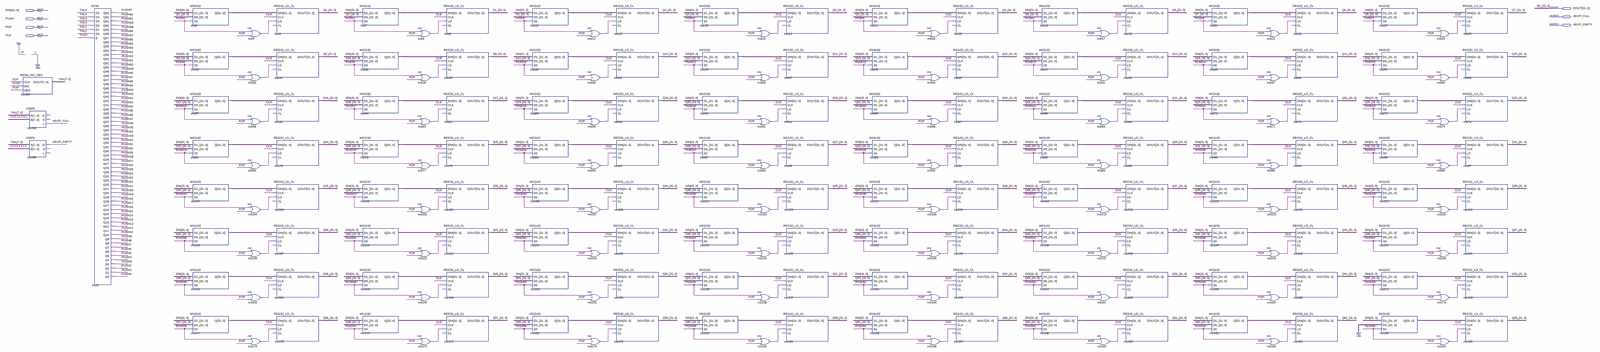
[diagram p0: schematic sheet, whole]
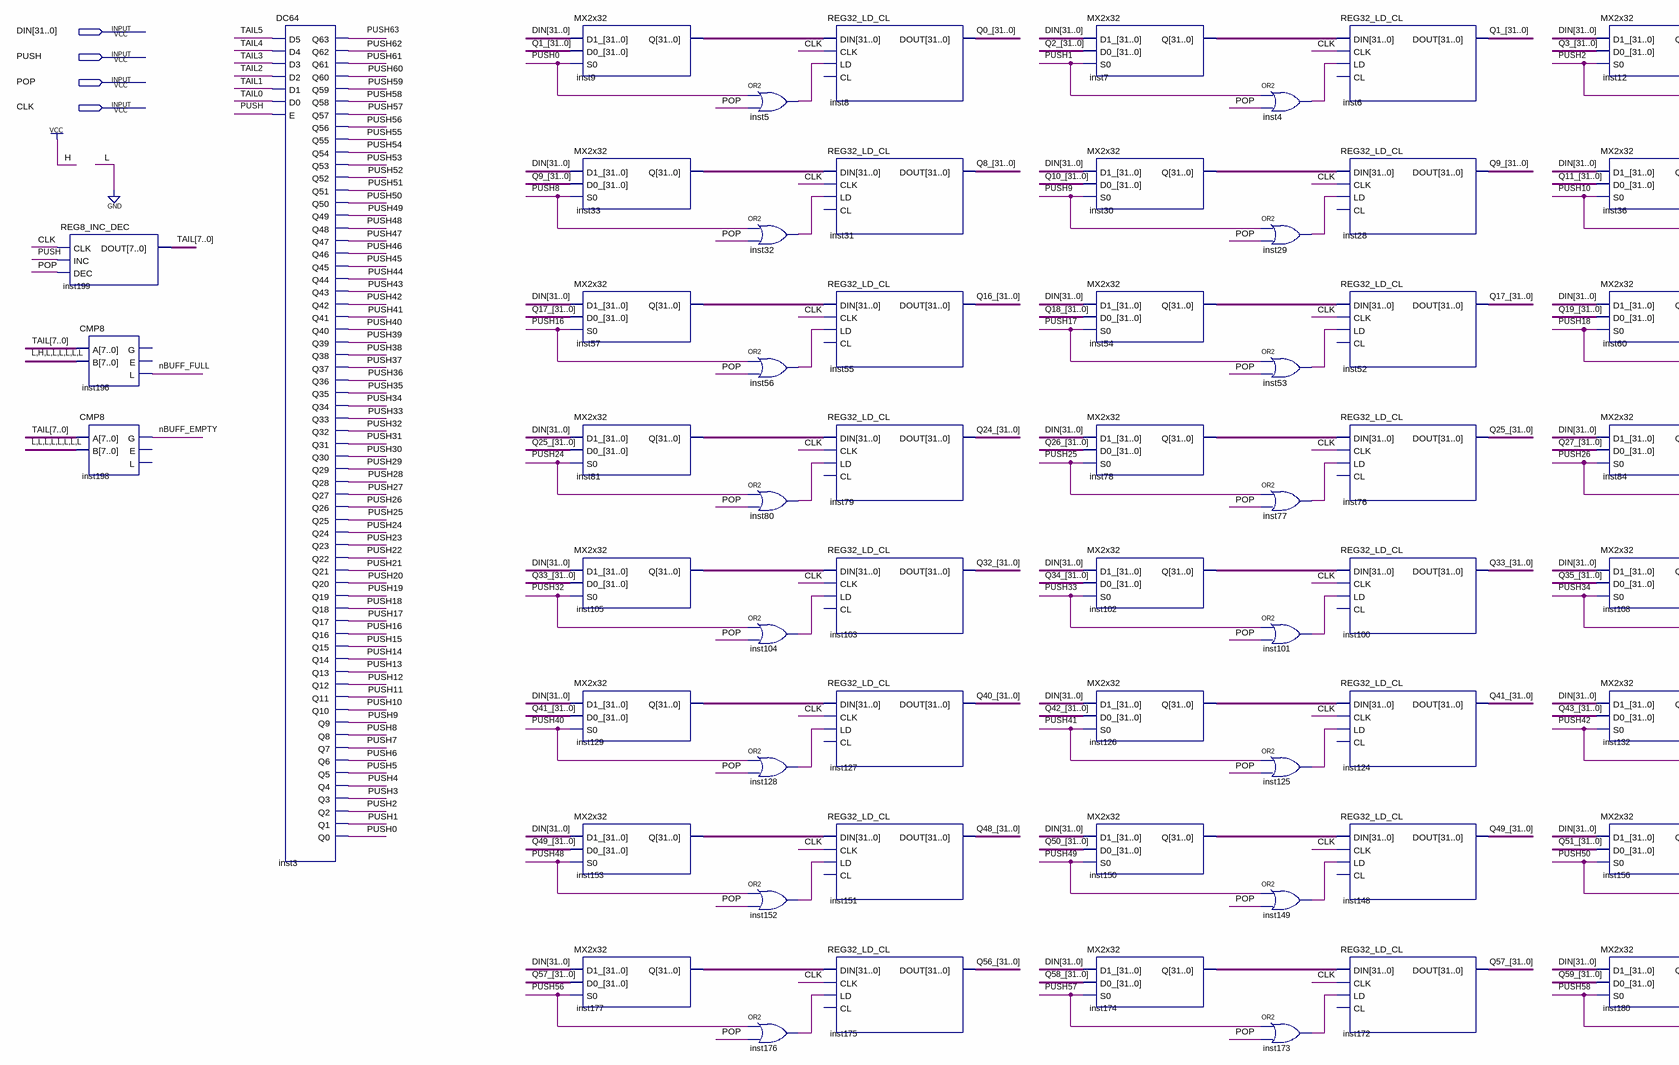
[diagram p1: schematic sheet, left part]
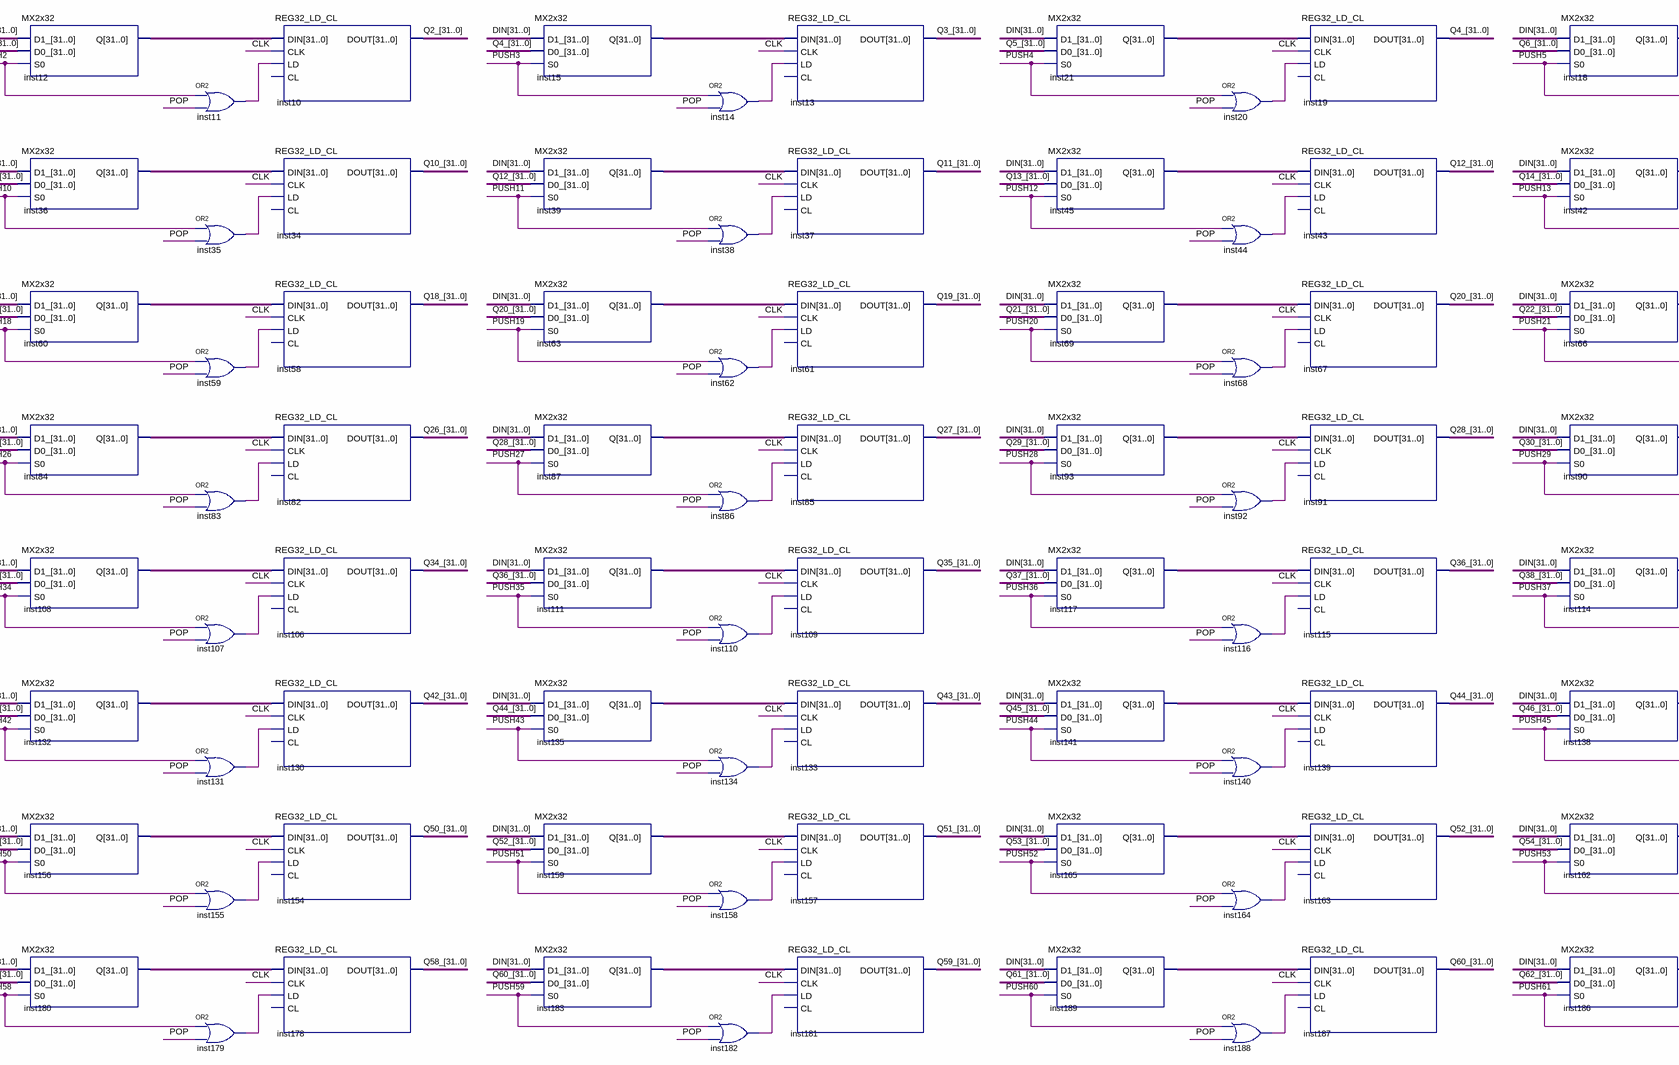
[diagram p2: schematic sheet, centre part]
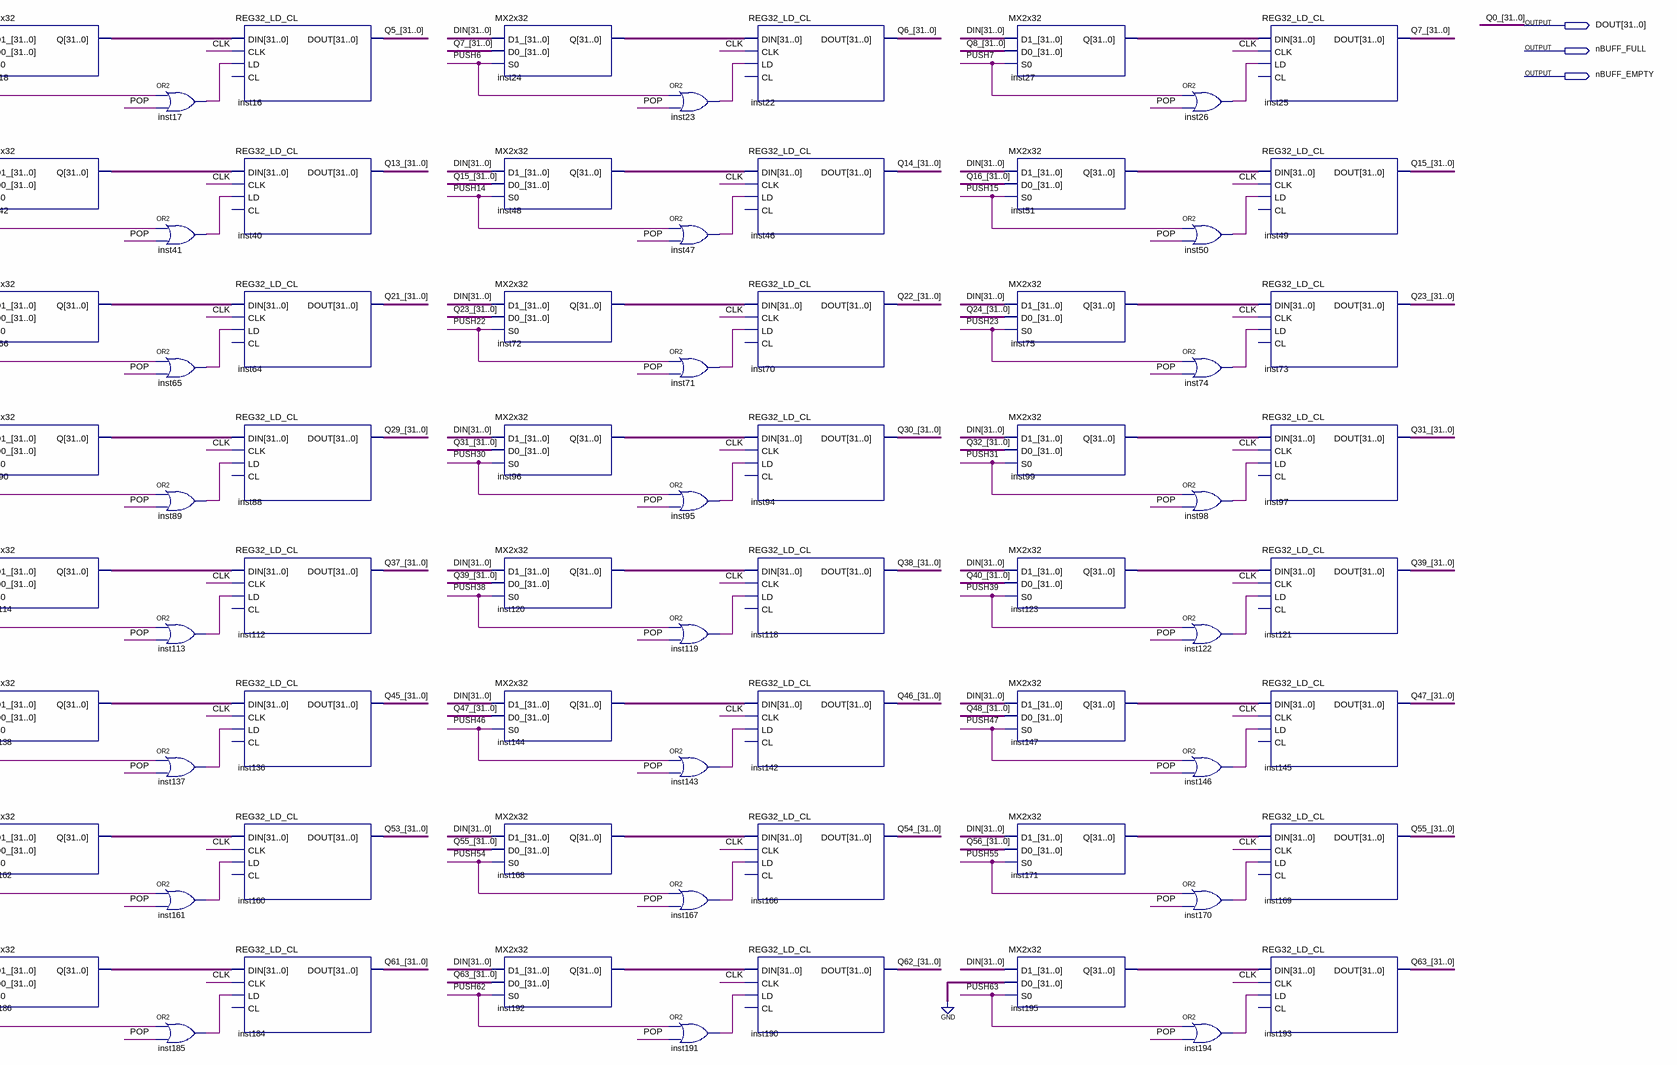
[diagram p3: schematic sheet, right part]
// Quartus schematic pixel_buffer.bdf as structural Verilog: 196 symbols, 7 pins
module pixel_buffer (
  input  [31:0] DIN,
  input  PUSH,
  input  POP,
  input  CLK,
  output [31:0] DOUT,
  output nBUFF_FULL,
  output nBUFF_EMPTY
);

  wire inst4_out, inst5_out, inst11_out, inst14_out, inst17_out, inst20_out, inst23_out, inst26_out,
       inst29_out, inst32_out, inst35_out, inst38_out, inst41_out, inst44_out, inst47_out, inst50_out,
       inst53_out, inst56_out, inst59_out, inst62_out, inst65_out, inst68_out, inst71_out, inst74_out,
       inst77_out, inst80_out, inst83_out, inst86_out, inst89_out, inst92_out, inst95_out, inst98_out,
       inst101_out, inst104_out, inst107_out, inst110_out, inst113_out, inst116_out, inst119_out,
       inst122_out, inst125_out, inst128_out, inst131_out, inst134_out, inst137_out, inst140_out,
       inst143_out, inst146_out, inst149_out, inst152_out, inst155_out, inst158_out, inst161_out,
       inst164_out, inst167_out, inst170_out, inst173_out, inst176_out, inst179_out, inst182_out,
       inst185_out, inst188_out, inst191_out, inst194_out, PUSH0, PUSH1, PUSH2, PUSH3, PUSH4, PUSH5, PUSH6,
       PUSH7, PUSH8, PUSH9, PUSH10, PUSH11, PUSH12, PUSH13, PUSH14, PUSH15, PUSH16, PUSH17, PUSH18, PUSH19,
       PUSH20, PUSH21, PUSH22, PUSH23, PUSH24, PUSH25, PUSH26, PUSH27, PUSH28, PUSH29, PUSH30, PUSH31,
       PUSH32, PUSH33, PUSH34, PUSH35, PUSH36, PUSH37, PUSH38, PUSH39, PUSH40, PUSH41, PUSH42, PUSH43,
       PUSH44, PUSH45, PUSH46, PUSH47, PUSH48, PUSH49, PUSH50, PUSH51, PUSH52, PUSH53, PUSH54, PUSH55,
       PUSH56, PUSH57, PUSH58, PUSH59, PUSH60, PUSH61, PUSH62, PUSH63;
  wire [7:0] TAIL;
  wire [31:0] inst7_q, inst9_q, inst12_q, inst15_q, inst18_q, inst21_q, inst24_q, inst27_q, inst30_q,
       inst33_q, inst36_q, inst39_q, inst42_q, inst45_q, inst48_q, inst51_q, inst54_q, inst57_q, inst60_q,
       inst63_q, inst66_q, inst69_q, inst72_q, inst75_q, inst78_q, inst81_q, inst84_q, inst87_q, inst90_q,
       inst93_q, inst96_q, inst99_q, inst102_q, inst105_q, inst108_q, inst111_q, inst114_q, inst117_q,
       inst120_q, inst123_q, inst126_q, inst129_q, inst132_q, inst135_q, inst138_q, inst141_q, inst144_q,
       inst147_q, inst150_q, inst153_q, inst156_q, inst159_q, inst162_q, inst165_q, inst168_q, inst171_q,
       inst174_q, inst177_q, inst180_q, inst183_q, inst186_q, inst189_q, inst192_q, inst195_q, Q1_, Q2_, Q3_,
       Q4_, Q5_, Q6_, Q7_, Q8_, Q9_, Q10_, Q11_, Q12_, Q13_, Q14_, Q15_, Q16_, Q17_, Q18_, Q19_, Q20_, Q21_,
       Q22_, Q23_, Q24_, Q25_, Q26_, Q27_, Q28_, Q29_, Q30_, Q31_, Q32_, Q33_, Q34_, Q35_, Q36_, Q37_, Q38_,
       Q39_, Q40_, Q41_, Q42_, Q43_, Q44_, Q45_, Q46_, Q47_, Q48_, Q49_, Q50_, Q51_, Q52_, Q53_, Q54_, Q55_,
       Q56_, Q57_, Q58_, Q59_, Q60_, Q61_, Q62_, Q63_;

  REG8_INC_DEC inst199 (.CLK(CLK), .INC(PUSH), .DEC(POP), .DOUT(TAIL));
  CMP8 inst196 (.A(TAIL), .B(8'b01000000), .L(nBUFF_FULL));  // open: G, E
  CMP8 inst198 (.A(TAIL), .B({8{1'b0}}), .G(nBUFF_EMPTY));  // open: E, L
  DC64 inst3 (
    .D5(TAIL[5]), .D4(TAIL[4]), .D3(TAIL[3]), .D2(TAIL[2]), .D1(TAIL[1]), .D0(TAIL[0]), .E(PUSH),
    .Q63(PUSH63), .Q62(PUSH62), .Q61(PUSH61), .Q60(PUSH60), .Q59(PUSH59), .Q58(PUSH58), .Q57(PUSH57),
    .Q56(PUSH56), .Q55(PUSH55), .Q54(PUSH54), .Q53(PUSH53), .Q52(PUSH52), .Q51(PUSH51), .Q50(PUSH50),
    .Q49(PUSH49), .Q48(PUSH48), .Q47(PUSH47), .Q46(PUSH46), .Q45(PUSH45), .Q44(PUSH44), .Q43(PUSH43),
    .Q42(PUSH42), .Q41(PUSH41), .Q40(PUSH40), .Q39(PUSH39), .Q38(PUSH38), .Q37(PUSH37), .Q36(PUSH36),
    .Q35(PUSH35), .Q34(PUSH34), .Q33(PUSH33), .Q32(PUSH32), .Q31(PUSH31), .Q30(PUSH30), .Q29(PUSH29),
    .Q28(PUSH28), .Q27(PUSH27), .Q26(PUSH26), .Q25(PUSH25), .Q24(PUSH24), .Q23(PUSH23), .Q22(PUSH22),
    .Q21(PUSH21), .Q20(PUSH20), .Q19(PUSH19), .Q18(PUSH18), .Q17(PUSH17), .Q16(PUSH16), .Q15(PUSH15),
    .Q14(PUSH14), .Q13(PUSH13), .Q12(PUSH12), .Q11(PUSH11), .Q10(PUSH10), .Q9(PUSH9), .Q8(PUSH8), .Q7(PUSH7),
    .Q6(PUSH6), .Q5(PUSH5), .Q4(PUSH4), .Q3(PUSH3), .Q2(PUSH2), .Q1(PUSH1), .Q0(PUSH0));
  MX2x32 inst9 (.D1_(DIN), .D0_(Q1_), .S0(PUSH0), .Q(inst9_q));
  MX2x32 inst33 (.D1_(DIN), .D0_(Q9_), .S0(PUSH8), .Q(inst33_q));
  MX2x32 inst57 (.D1_(DIN), .D0_(Q17_), .S0(PUSH16), .Q(inst57_q));
  MX2x32 inst81 (.D1_(DIN), .D0_(Q25_), .S0(PUSH24), .Q(inst81_q));
  MX2x32 inst105 (.D1_(DIN), .D0_(Q33_), .S0(PUSH32), .Q(inst105_q));
  MX2x32 inst129 (.D1_(DIN), .D0_(Q41_), .S0(PUSH40), .Q(inst129_q));
  MX2x32 inst153 (.D1_(DIN), .D0_(Q49_), .S0(PUSH48), .Q(inst153_q));
  MX2x32 inst177 (.D1_(DIN), .D0_(Q57_), .S0(PUSH56), .Q(inst177_q));
  or inst5 (inst5_out, PUSH0, POP);
  or inst32 (inst32_out, PUSH8, POP);
  or inst56 (inst56_out, PUSH16, POP);
  or inst80 (inst80_out, PUSH24, POP);
  or inst104 (inst104_out, PUSH32, POP);
  or inst128 (inst128_out, PUSH40, POP);
  or inst152 (inst152_out, PUSH48, POP);
  or inst176 (inst176_out, PUSH56, POP);
  REG32_LD_CL inst8 (.DIN(inst9_q), .CLK(CLK), .LD(inst5_out), .DOUT(DOUT));  // open: CL
  REG32_LD_CL inst31 (.DIN(inst33_q), .CLK(CLK), .LD(inst32_out), .DOUT(Q8_));  // open: CL
  REG32_LD_CL inst55 (.DIN(inst57_q), .CLK(CLK), .LD(inst56_out), .DOUT(Q16_));  // open: CL
  REG32_LD_CL inst79 (.DIN(inst81_q), .CLK(CLK), .LD(inst80_out), .DOUT(Q24_));  // open: CL
  REG32_LD_CL inst103 (.DIN(inst105_q), .CLK(CLK), .LD(inst104_out), .DOUT(Q32_));  // open: CL
  REG32_LD_CL inst127 (.DIN(inst129_q), .CLK(CLK), .LD(inst128_out), .DOUT(Q40_));  // open: CL
  REG32_LD_CL inst151 (.DIN(inst153_q), .CLK(CLK), .LD(inst152_out), .DOUT(Q48_));  // open: CL
  REG32_LD_CL inst175 (.DIN(inst177_q), .CLK(CLK), .LD(inst176_out), .DOUT(Q56_));  // open: CL
  MX2x32 inst7 (.D1_(DIN), .D0_(Q2_), .S0(PUSH1), .Q(inst7_q));
  MX2x32 inst30 (.D1_(DIN), .D0_(Q10_), .S0(PUSH9), .Q(inst30_q));
  MX2x32 inst54 (.D1_(DIN), .D0_(Q18_), .S0(PUSH17), .Q(inst54_q));
  MX2x32 inst78 (.D1_(DIN), .D0_(Q26_), .S0(PUSH25), .Q(inst78_q));
  MX2x32 inst102 (.D1_(DIN), .D0_(Q34_), .S0(PUSH33), .Q(inst102_q));
  MX2x32 inst126 (.D1_(DIN), .D0_(Q42_), .S0(PUSH41), .Q(inst126_q));
  MX2x32 inst150 (.D1_(DIN), .D0_(Q50_), .S0(PUSH49), .Q(inst150_q));
  MX2x32 inst174 (.D1_(DIN), .D0_(Q58_), .S0(PUSH57), .Q(inst174_q));
  or inst4 (inst4_out, PUSH1, POP);
  or inst29 (inst29_out, PUSH9, POP);
  or inst53 (inst53_out, PUSH17, POP);
  or inst77 (inst77_out, PUSH25, POP);
  or inst101 (inst101_out, PUSH33, POP);
  or inst125 (inst125_out, PUSH41, POP);
  or inst149 (inst149_out, PUSH49, POP);
  or inst173 (inst173_out, PUSH57, POP);
  REG32_LD_CL inst6 (.DIN(inst7_q), .CLK(CLK), .LD(inst4_out), .DOUT(Q1_));  // open: CL
  REG32_LD_CL inst28 (.DIN(inst30_q), .CLK(CLK), .LD(inst29_out), .DOUT(Q9_));  // open: CL
  REG32_LD_CL inst52 (.DIN(inst54_q), .CLK(CLK), .LD(inst53_out), .DOUT(Q17_));  // open: CL
  REG32_LD_CL inst76 (.DIN(inst78_q), .CLK(CLK), .LD(inst77_out), .DOUT(Q25_));  // open: CL
  REG32_LD_CL inst100 (.DIN(inst102_q), .CLK(CLK), .LD(inst101_out), .DOUT(Q33_));  // open: CL
  REG32_LD_CL inst124 (.DIN(inst126_q), .CLK(CLK), .LD(inst125_out), .DOUT(Q41_));  // open: CL
  REG32_LD_CL inst148 (.DIN(inst150_q), .CLK(CLK), .LD(inst149_out), .DOUT(Q49_));  // open: CL
  REG32_LD_CL inst172 (.DIN(inst174_q), .CLK(CLK), .LD(inst173_out), .DOUT(Q57_));  // open: CL
  MX2x32 inst12 (.D1_(DIN), .D0_(Q3_), .S0(PUSH2), .Q(inst12_q));
  MX2x32 inst36 (.D1_(DIN), .D0_(Q11_), .S0(PUSH10), .Q(inst36_q));
  MX2x32 inst60 (.D1_(DIN), .D0_(Q19_), .S0(PUSH18), .Q(inst60_q));
  MX2x32 inst84 (.D1_(DIN), .D0_(Q27_), .S0(PUSH26), .Q(inst84_q));
  MX2x32 inst108 (.D1_(DIN), .D0_(Q35_), .S0(PUSH34), .Q(inst108_q));
  MX2x32 inst132 (.D1_(DIN), .D0_(Q43_), .S0(PUSH42), .Q(inst132_q));
  MX2x32 inst156 (.D1_(DIN), .D0_(Q51_), .S0(PUSH50), .Q(inst156_q));
  MX2x32 inst180 (.D1_(DIN), .D0_(Q59_), .S0(PUSH58), .Q(inst180_q));
  or inst11 (inst11_out, PUSH2, POP);
  or inst35 (inst35_out, PUSH10, POP);
  or inst59 (inst59_out, PUSH18, POP);
  or inst83 (inst83_out, PUSH26, POP);
  or inst107 (inst107_out, PUSH34, POP);
  or inst131 (inst131_out, PUSH42, POP);
  or inst155 (inst155_out, PUSH50, POP);
  or inst179 (inst179_out, PUSH58, POP);
  REG32_LD_CL inst10 (.DIN(inst12_q), .CLK(CLK), .LD(inst11_out), .DOUT(Q2_));  // open: CL
  REG32_LD_CL inst34 (.DIN(inst36_q), .CLK(CLK), .LD(inst35_out), .DOUT(Q10_));  // open: CL
  REG32_LD_CL inst58 (.DIN(inst60_q), .CLK(CLK), .LD(inst59_out), .DOUT(Q18_));  // open: CL
  REG32_LD_CL inst82 (.DIN(inst84_q), .CLK(CLK), .LD(inst83_out), .DOUT(Q26_));  // open: CL
  REG32_LD_CL inst106 (.DIN(inst108_q), .CLK(CLK), .LD(inst107_out), .DOUT(Q34_));  // open: CL
  REG32_LD_CL inst130 (.DIN(inst132_q), .CLK(CLK), .LD(inst131_out), .DOUT(Q42_));  // open: CL
  REG32_LD_CL inst154 (.DIN(inst156_q), .CLK(CLK), .LD(inst155_out), .DOUT(Q50_));  // open: CL
  REG32_LD_CL inst178 (.DIN(inst180_q), .CLK(CLK), .LD(inst179_out), .DOUT(Q58_));  // open: CL
  MX2x32 inst15 (.D1_(DIN), .D0_(Q4_), .S0(PUSH3), .Q(inst15_q));
  MX2x32 inst39 (.D1_(DIN), .D0_(Q12_), .S0(PUSH11), .Q(inst39_q));
  MX2x32 inst63 (.D1_(DIN), .D0_(Q20_), .S0(PUSH19), .Q(inst63_q));
  MX2x32 inst87 (.D1_(DIN), .D0_(Q28_), .S0(PUSH27), .Q(inst87_q));
  MX2x32 inst111 (.D1_(DIN), .D0_(Q36_), .S0(PUSH35), .Q(inst111_q));
  MX2x32 inst135 (.D1_(DIN), .D0_(Q44_), .S0(PUSH43), .Q(inst135_q));
  MX2x32 inst159 (.D1_(DIN), .D0_(Q52_), .S0(PUSH51), .Q(inst159_q));
  MX2x32 inst183 (.D1_(DIN), .D0_(Q60_), .S0(PUSH59), .Q(inst183_q));
  or inst14 (inst14_out, PUSH3, POP);
  or inst38 (inst38_out, PUSH11, POP);
  or inst62 (inst62_out, PUSH19, POP);
  or inst86 (inst86_out, PUSH27, POP);
  or inst110 (inst110_out, PUSH35, POP);
  or inst134 (inst134_out, PUSH43, POP);
  or inst158 (inst158_out, PUSH51, POP);
  or inst182 (inst182_out, PUSH59, POP);
  REG32_LD_CL inst13 (.DIN(inst15_q), .CLK(CLK), .LD(inst14_out), .DOUT(Q3_));  // open: CL
  REG32_LD_CL inst37 (.DIN(inst39_q), .CLK(CLK), .LD(inst38_out), .DOUT(Q11_));  // open: CL
  REG32_LD_CL inst61 (.DIN(inst63_q), .CLK(CLK), .LD(inst62_out), .DOUT(Q19_));  // open: CL
  REG32_LD_CL inst85 (.DIN(inst87_q), .CLK(CLK), .LD(inst86_out), .DOUT(Q27_));  // open: CL
  REG32_LD_CL inst109 (.DIN(inst111_q), .CLK(CLK), .LD(inst110_out), .DOUT(Q35_));  // open: CL
  REG32_LD_CL inst133 (.DIN(inst135_q), .CLK(CLK), .LD(inst134_out), .DOUT(Q43_));  // open: CL
  REG32_LD_CL inst157 (.DIN(inst159_q), .CLK(CLK), .LD(inst158_out), .DOUT(Q51_));  // open: CL
  REG32_LD_CL inst181 (.DIN(inst183_q), .CLK(CLK), .LD(inst182_out), .DOUT(Q59_));  // open: CL
  MX2x32 inst21 (.D1_(DIN), .D0_(Q5_), .S0(PUSH4), .Q(inst21_q));
  MX2x32 inst45 (.D1_(DIN), .D0_(Q13_), .S0(PUSH12), .Q(inst45_q));
  MX2x32 inst69 (.D1_(DIN), .D0_(Q21_), .S0(PUSH20), .Q(inst69_q));
  MX2x32 inst93 (.D1_(DIN), .D0_(Q29_), .S0(PUSH28), .Q(inst93_q));
  MX2x32 inst117 (.D1_(DIN), .D0_(Q37_), .S0(PUSH36), .Q(inst117_q));
  MX2x32 inst141 (.D1_(DIN), .D0_(Q45_), .S0(PUSH44), .Q(inst141_q));
  MX2x32 inst165 (.D1_(DIN), .D0_(Q53_), .S0(PUSH52), .Q(inst165_q));
  MX2x32 inst189 (.D1_(DIN), .D0_(Q61_), .S0(PUSH60), .Q(inst189_q));
  or inst20 (inst20_out, PUSH4, POP);
  or inst44 (inst44_out, PUSH12, POP);
  or inst68 (inst68_out, PUSH20, POP);
  or inst92 (inst92_out, PUSH28, POP);
  or inst116 (inst116_out, PUSH36, POP);
  or inst140 (inst140_out, PUSH44, POP);
  or inst164 (inst164_out, PUSH52, POP);
  or inst188 (inst188_out, PUSH60, POP);
  REG32_LD_CL inst19 (.DIN(inst21_q), .CLK(CLK), .LD(inst20_out), .DOUT(Q4_));  // open: CL
  REG32_LD_CL inst43 (.DIN(inst45_q), .CLK(CLK), .LD(inst44_out), .DOUT(Q12_));  // open: CL
  REG32_LD_CL inst67 (.DIN(inst69_q), .CLK(CLK), .LD(inst68_out), .DOUT(Q20_));  // open: CL
  REG32_LD_CL inst91 (.DIN(inst93_q), .CLK(CLK), .LD(inst92_out), .DOUT(Q28_));  // open: CL
  REG32_LD_CL inst115 (.DIN(inst117_q), .CLK(CLK), .LD(inst116_out), .DOUT(Q36_));  // open: CL
  REG32_LD_CL inst139 (.DIN(inst141_q), .CLK(CLK), .LD(inst140_out), .DOUT(Q44_));  // open: CL
  REG32_LD_CL inst163 (.DIN(inst165_q), .CLK(CLK), .LD(inst164_out), .DOUT(Q52_));  // open: CL
  REG32_LD_CL inst187 (.DIN(inst189_q), .CLK(CLK), .LD(inst188_out), .DOUT(Q60_));  // open: CL
  MX2x32 inst18 (.D1_(DIN), .D0_(Q6_), .S0(PUSH5), .Q(inst18_q));
  MX2x32 inst42 (.D1_(DIN), .D0_(Q14_), .S0(PUSH13), .Q(inst42_q));
  MX2x32 inst66 (.D1_(DIN), .D0_(Q22_), .S0(PUSH21), .Q(inst66_q));
  MX2x32 inst90 (.D1_(DIN), .D0_(Q30_), .S0(PUSH29), .Q(inst90_q));
  MX2x32 inst114 (.D1_(DIN), .D0_(Q38_), .S0(PUSH37), .Q(inst114_q));
  MX2x32 inst138 (.D1_(DIN), .D0_(Q46_), .S0(PUSH45), .Q(inst138_q));
  MX2x32 inst162 (.D1_(DIN), .D0_(Q54_), .S0(PUSH53), .Q(inst162_q));
  MX2x32 inst186 (.D1_(DIN), .D0_(Q62_), .S0(PUSH61), .Q(inst186_q));
  or inst17 (inst17_out, PUSH5, POP);
  or inst41 (inst41_out, PUSH13, POP);
  or inst65 (inst65_out, PUSH21, POP);
  or inst89 (inst89_out, PUSH29, POP);
  or inst113 (inst113_out, PUSH37, POP);
  or inst137 (inst137_out, PUSH45, POP);
  or inst161 (inst161_out, PUSH53, POP);
  or inst185 (inst185_out, PUSH61, POP);
  REG32_LD_CL inst16 (.DIN(inst18_q), .CLK(CLK), .LD(inst17_out), .DOUT(Q5_));  // open: CL
  REG32_LD_CL inst40 (.DIN(inst42_q), .CLK(CLK), .LD(inst41_out), .DOUT(Q13_));  // open: CL
  REG32_LD_CL inst64 (.DIN(inst66_q), .CLK(CLK), .LD(inst65_out), .DOUT(Q21_));  // open: CL
  REG32_LD_CL inst88 (.DIN(inst90_q), .CLK(CLK), .LD(inst89_out), .DOUT(Q29_));  // open: CL
  REG32_LD_CL inst112 (.DIN(inst114_q), .CLK(CLK), .LD(inst113_out), .DOUT(Q37_));  // open: CL
  REG32_LD_CL inst136 (.DIN(inst138_q), .CLK(CLK), .LD(inst137_out), .DOUT(Q45_));  // open: CL
  REG32_LD_CL inst160 (.DIN(inst162_q), .CLK(CLK), .LD(inst161_out), .DOUT(Q53_));  // open: CL
  REG32_LD_CL inst184 (.DIN(inst186_q), .CLK(CLK), .LD(inst185_out), .DOUT(Q61_));  // open: CL
  MX2x32 inst24 (.D1_(DIN), .D0_(Q7_), .S0(PUSH6), .Q(inst24_q));
  MX2x32 inst48 (.D1_(DIN), .D0_(Q15_), .S0(PUSH14), .Q(inst48_q));
  MX2x32 inst72 (.D1_(DIN), .D0_(Q23_), .S0(PUSH22), .Q(inst72_q));
  MX2x32 inst96 (.D1_(DIN), .D0_(Q31_), .S0(PUSH30), .Q(inst96_q));
  MX2x32 inst120 (.D1_(DIN), .D0_(Q39_), .S0(PUSH38), .Q(inst120_q));
  MX2x32 inst144 (.D1_(DIN), .D0_(Q47_), .S0(PUSH46), .Q(inst144_q));
  MX2x32 inst168 (.D1_(DIN), .D0_(Q55_), .S0(PUSH54), .Q(inst168_q));
  MX2x32 inst192 (.D1_(DIN), .D0_(Q63_), .S0(PUSH62), .Q(inst192_q));
  or inst23 (inst23_out, PUSH6, POP);
  or inst47 (inst47_out, PUSH14, POP);
  or inst71 (inst71_out, PUSH22, POP);
  or inst95 (inst95_out, PUSH30, POP);
  or inst119 (inst119_out, PUSH38, POP);
  or inst143 (inst143_out, PUSH46, POP);
  or inst167 (inst167_out, PUSH54, POP);
  or inst191 (inst191_out, PUSH62, POP);
  REG32_LD_CL inst22 (.DIN(inst24_q), .CLK(CLK), .LD(inst23_out), .DOUT(Q6_));  // open: CL
  REG32_LD_CL inst46 (.DIN(inst48_q), .CLK(CLK), .LD(inst47_out), .DOUT(Q14_));  // open: CL
  REG32_LD_CL inst70 (.DIN(inst72_q), .CLK(CLK), .LD(inst71_out), .DOUT(Q22_));  // open: CL
  REG32_LD_CL inst94 (.DIN(inst96_q), .CLK(CLK), .LD(inst95_out), .DOUT(Q30_));  // open: CL
  REG32_LD_CL inst118 (.DIN(inst120_q), .CLK(CLK), .LD(inst119_out), .DOUT(Q38_));  // open: CL
  REG32_LD_CL inst142 (.DIN(inst144_q), .CLK(CLK), .LD(inst143_out), .DOUT(Q46_));  // open: CL
  REG32_LD_CL inst166 (.DIN(inst168_q), .CLK(CLK), .LD(inst167_out), .DOUT(Q54_));  // open: CL
  REG32_LD_CL inst190 (.DIN(inst192_q), .CLK(CLK), .LD(inst191_out), .DOUT(Q62_));  // open: CL
  MX2x32 inst27 (.D1_(DIN), .D0_(Q8_), .S0(PUSH7), .Q(inst27_q));
  MX2x32 inst51 (.D1_(DIN), .D0_(Q16_), .S0(PUSH15), .Q(inst51_q));
  MX2x32 inst75 (.D1_(DIN), .D0_(Q24_), .S0(PUSH23), .Q(inst75_q));
  MX2x32 inst99 (.D1_(DIN), .D0_(Q32_), .S0(PUSH31), .Q(inst99_q));
  MX2x32 inst123 (.D1_(DIN), .D0_(Q40_), .S0(PUSH39), .Q(inst123_q));
  MX2x32 inst147 (.D1_(DIN), .D0_(Q48_), .S0(PUSH47), .Q(inst147_q));
  MX2x32 inst171 (.D1_(DIN), .D0_(Q56_), .S0(PUSH55), .Q(inst171_q));
  MX2x32 inst195 (.D1_(DIN), .D0_({32{1'b0}}), .S0(PUSH63), .Q(inst195_q));
  or inst26 (inst26_out, PUSH7, POP);
  or inst50 (inst50_out, PUSH15, POP);
  or inst74 (inst74_out, PUSH23, POP);
  or inst98 (inst98_out, PUSH31, POP);
  or inst122 (inst122_out, PUSH39, POP);
  or inst146 (inst146_out, PUSH47, POP);
  or inst170 (inst170_out, PUSH55, POP);
  or inst194 (inst194_out, PUSH63, POP);
  REG32_LD_CL inst25 (.DIN(inst27_q), .CLK(CLK), .LD(inst26_out), .DOUT(Q7_));  // open: CL
  REG32_LD_CL inst49 (.DIN(inst51_q), .CLK(CLK), .LD(inst50_out), .DOUT(Q15_));  // open: CL
  REG32_LD_CL inst73 (.DIN(inst75_q), .CLK(CLK), .LD(inst74_out), .DOUT(Q23_));  // open: CL
  REG32_LD_CL inst97 (.DIN(inst99_q), .CLK(CLK), .LD(inst98_out), .DOUT(Q31_));  // open: CL
  REG32_LD_CL inst121 (.DIN(inst123_q), .CLK(CLK), .LD(inst122_out), .DOUT(Q39_));  // open: CL
  REG32_LD_CL inst145 (.DIN(inst147_q), .CLK(CLK), .LD(inst146_out), .DOUT(Q47_));  // open: CL
  REG32_LD_CL inst169 (.DIN(inst171_q), .CLK(CLK), .LD(inst170_out), .DOUT(Q55_));  // open: CL
  REG32_LD_CL inst193 (.DIN(inst195_q), .CLK(CLK), .LD(inst194_out), .DOUT(Q63_));  // open: CL

  // Other names for the same wires on the sheet: Q0_[31:0] = DOUT
endmodule
